# Altium project quadruped.PrjPCB
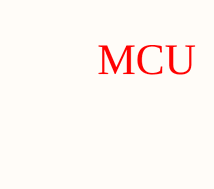
[diagram p0: quadruped.SchDoc, top left]
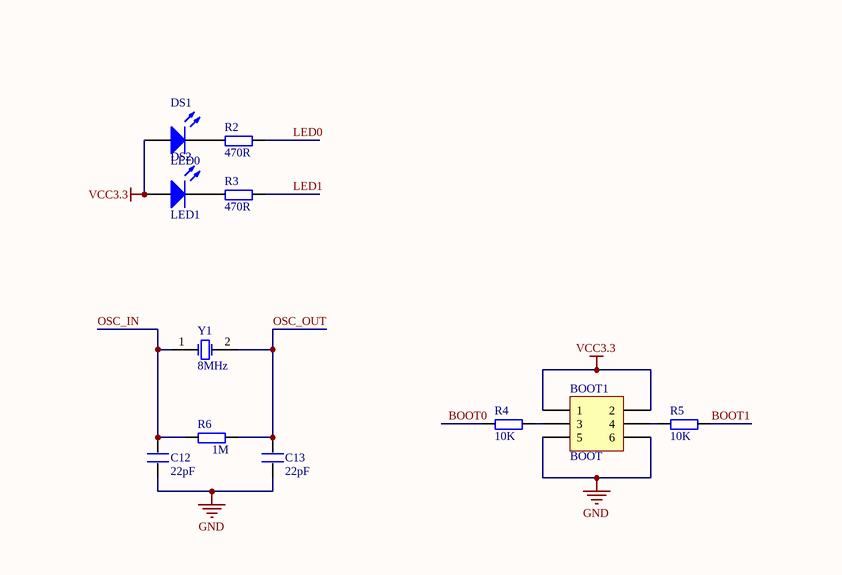
[diagram p1: quadruped.SchDoc, top right]
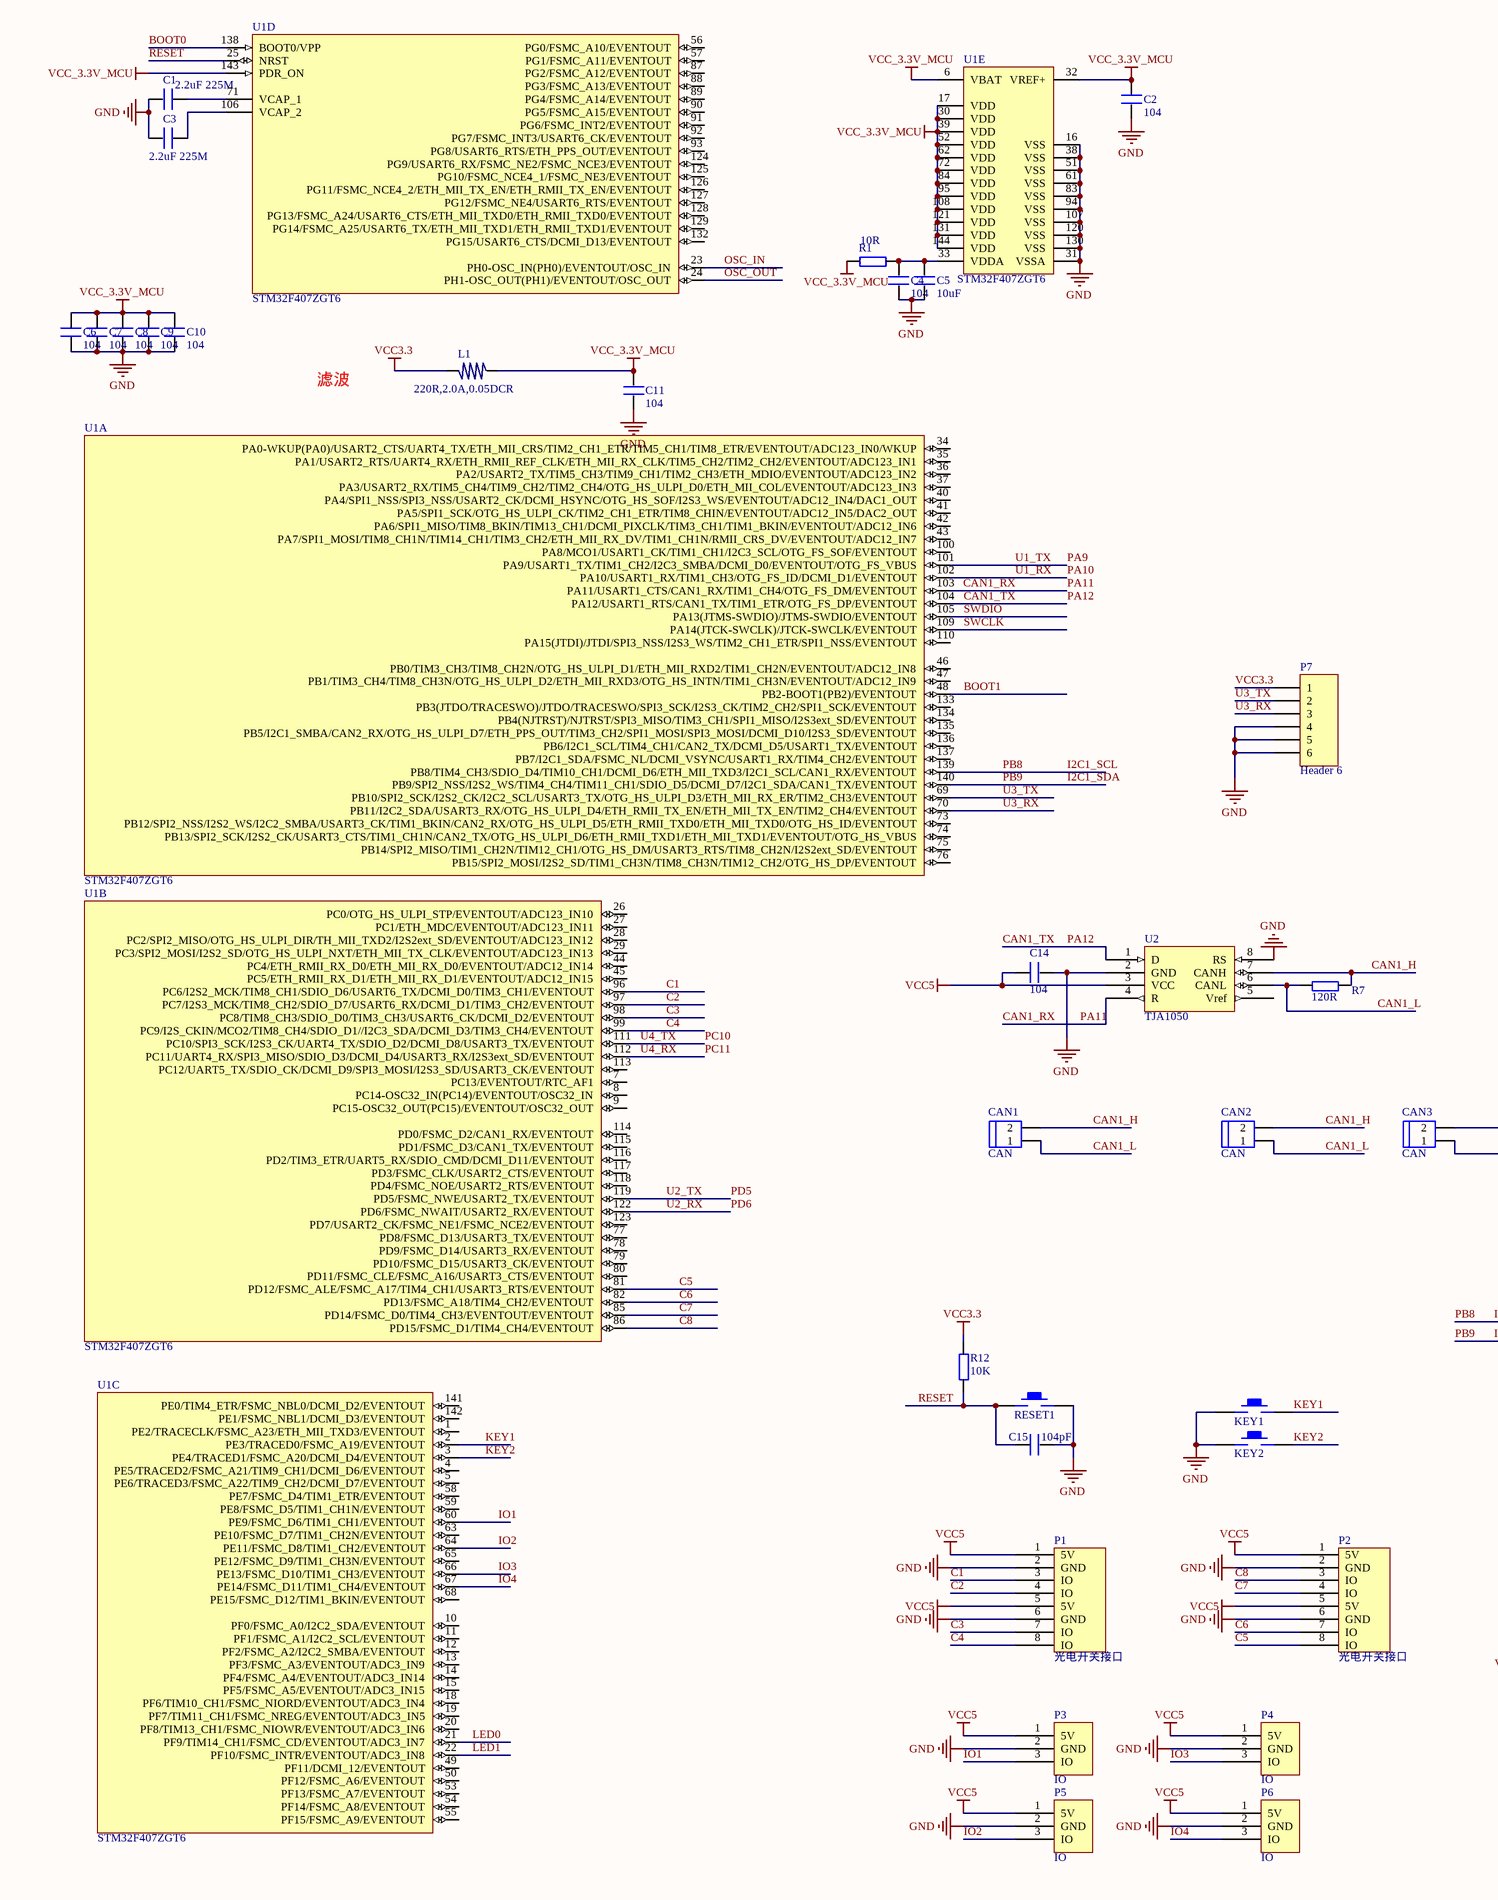
[diagram p2: quadruped.SchDoc, bottom left]
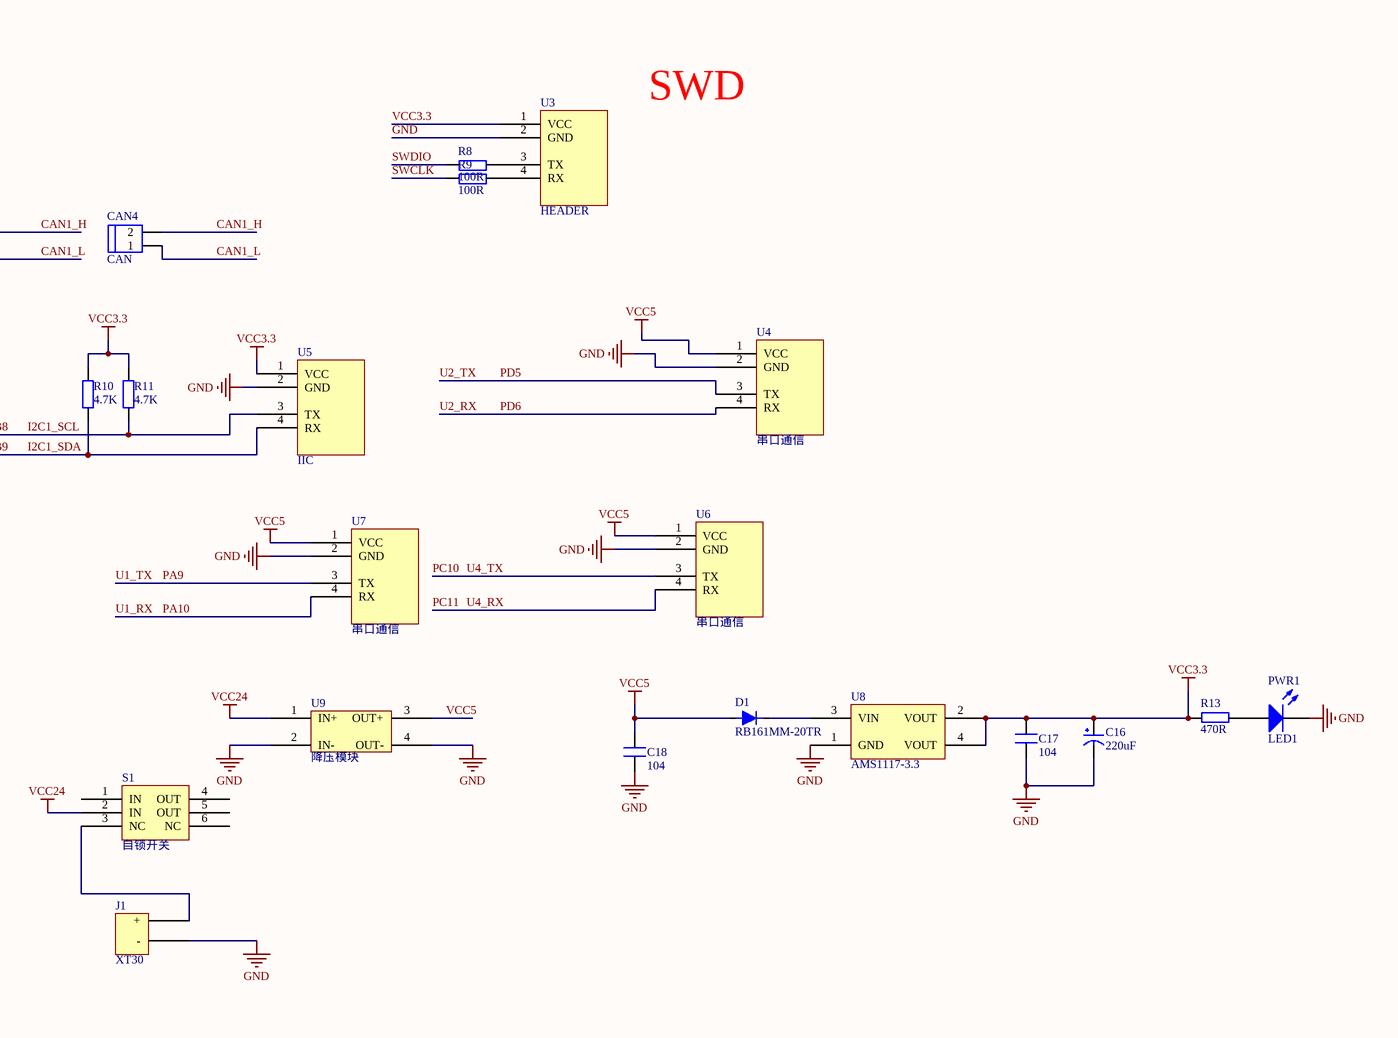
[diagram p3: quadruped.SchDoc, bottom right]
1 sheet, 63 parts. Net scope: global (net labels, ports and power ports of the same name join across sheets).
Board file: quadruped.PcbDoc

## Sheet quadruped.SchDoc
size A1

### Parts
BOOT1  BOOT  [HDR2X3]
C1  2.2uF 225M  [0603C]
C2  104  [0603C]
C3  2.2uF 225M  [0603C]
C4  104  [0603C]
C5  10uF  [0603C]
C6  104  [0603C]
C7  104  [0603C]
C8  104  [0603C]
C9  104  [0603C]
C10  104  [0603C]
C11  104  [0603C]
C12  22pF  [0603C]
C13  22pF  [0603C]
C14  104  [0603C]
C15  104pF  [C0603]
C16  220uF  [C3528]
C17  104  [0603C]
C18  104  [0603C]
CAN1  CAN  [KF3.81直针-2P]
CAN2  CAN  [KF3.81直针-2P]
CAN3  CAN  [KF3.81直针-2P]
CAN4  CAN  [KF3.81直针-2P]
D1  RB161MM-20TR  [LC-SOD-123F]
DS1  LED0  [0603_LED]
DS2  LED1  [0603_LED]
J1  XT30  [POWER_PAD]
KEY1  KEY0  [KEY_M]  (value not drawn)
KEY2  KEY0  [KEY_M]  (value not drawn)
L1  220R,2.0A,0.05DCR  [0603_L]
P1  光电开关接口  [KF3.81直针-8P]
P2  光电开关接口  [KF3.81直针-8P]
P3  IO  [KF3.81直针-3P]
P4  IO  [KF3.81直针-3P]
P5  IO  [KF3.81直针-3P]
P6  IO  [KF3.81直针-3P]
P7  Header 6  [HDR1X6]
PWR1  LED1  [0603_LED]
R1  10R  [0603R]
R2  470R  [0603R]
R3  470R  [0603R]
R4  10K  [R0603]
R5  10K  [R0603]
R6  1M  [0603R]
R7  120R  [0603R]
R8  100R  [0603R]
R9  100R  [0603R]
R10  4.7K  [0603R]
R11  4.7K  [0603R]
R12  10K  [R0603]
R13  470R  [0603R]
RESET1  KEY_M  [KEY_4]  (value not drawn)
S1  自锁开关  [自锁开关5.8*5.8]
U1  STM32F407ZGT6  [LQFP144]  (parts A,B,C,D,E of 5)
U2  TJA1050  [SOP8]
U3  HEADER  [XH2.54-4]
U4  串口通信  [XH2.54-4]
U5  IIC  [XH2.54-4]
U6  串口通信  [XH2.54-4]
U7  串口通信  [XH2.54-4]
U8  AMS1117-3.3  [SOT223]
U9  降压模块  [MP1584N DC-DC]
Y1  8MHz  [XTAL_US]

### Nets
GND: BOOT1.5 BOOT1.6 C1.1 C2.1 C3.2 C4.1 C5.1 C6.1 C7.1 C8.1 C9.1 C10.1 C11.1 C12.1 C13.1 C14.2 C15.1 C16.2(GND) C17.1 C18.1 J1.0(-) KEY1.1 KEY2.1 P1.2(GND) P1.6(GND) P2.2(GND) P2.6(GND) P3.2(GND) P4.2(GND) P5.2(GND) P6.2(GND) P7.4 P7.5 P7.6 PWR1.2(K) RESET1.2 U1.16(VSS) U1.31(VSSA) U1.38(VSS) U1.51(VSS) U1.61(VSS) U1.83(VSS) U1.94(VSS) U1.107(VSS) U1.120(VSS) U1.130(VSS) U2.2(GND) U2.8(RS) U3.2(GND) U4.2(GND) U5.2(GND) U6.2(GND) U7.2(GND) U8.1(GND) U9.2(IN-) U9.4(OUT-)
VCC3.3: BOOT1.1 BOOT1.2 C16.1(VCC) C17.2 DS1.1(A) DS2.1(A) L1.2 P7.1 R10.2 R11.2 R12.2 R13.2 U3.1(VCC) U5.1(VCC) U8.2(VOUT) U8.4(VOUT)
VCC5: C14.1 C18.2 D1.1 P1.1(5V) P1.5(5V) P2.1(5V) P2.5(5V) P3.1(5V) P4.1(5V) P5.1(5V) P6.1(5V) U2.3(VCC) U4.1(VCC) U6.1(VCC) U7.1(VCC) U9.3(OUT+)
VCC24: S1.2(IN) U9.1(IN+)
VCC_3.3V_MCU: C2.2 C6.2 C7.2 C8.2 C9.2 C10.2 C11.2 L1.1 R1.1 U1.6(VBAT) U1.17(VDD) U1.30(VDD) U1.32(VREF+) U1.39(VDD) U1.52(VDD) U1.62(VDD) U1.72(VDD) U1.84(VDD) U1.95(VDD) U1.108(VDD) U1.121(VDD) U1.131(VDD) U1.143(PDR_ON) U1.144(VDD)
BOOT0: R4.1 U1.138(BOOT0/VPP)
BOOT1: R5.2 U1.48(PB2-BOOT1(PB2)/EVENTOUT)
C1: P1.3(IO) U1.96(PC6/I2S2_MCK/TIM8_CH1/SDIO_D6/USART6_TX/DCMI_D0/TIM3_CH1/EVENTOUT)
C2: P1.4(IO) U1.97(PC7/I2S3_MCK/TIM8_CH2/SDIO_D7/USART6_RX/DCMI_D1/TIM3_CH2/EVENTOUT)
C3: P1.7(IO) U1.98(PC8/TIM8_CH3/SDIO_D0/TIM3_CH3/USART6_CK/DCMI_D2/EVENTOUT)
C4: P1.8(IO) U1.99(PC9/I2S_CKIN/MCO2/TIM8_CH4/SDIO_D1//I2C3_SDA/DCMI_D3/TIM3_CH4/EVENTOUT)
C5: P2.8(IO) U1.81(PD12/FSMC_ALE/FSMC_A17/TIM4_CH1/USART3_RTS/EVENTOUT)
C6: P2.7(IO) U1.82(PD13/FSMC_A18/TIM4_CH2/EVENTOUT)
C7: P2.4(IO) U1.85(PD14/FSMC_D0/TIM4_CH3/EVENTOUT/EVENTOUT)
C8: P2.3(IO) U1.86(PD15/FSMC_D1/TIM4_CH4/EVENTOUT)
CAN1_H: CAN1.2 CAN2.2 CAN3.2 CAN4.2 R7.2 U2.7(CANH)
CAN1_L: CAN1.1 CAN2.1 CAN3.1 CAN4.1 R7.1 U2.6(CANL)
CAN1_RX: U1.103(PA11/USART1_CTS/CAN1_RX/TIM1_CH4/OTG_FS_DM/EVENTOUT) U2.4(R)  [also labelled PA11]
CAN1_TX: U1.104(PA12/USART1_RTS/CAN1_TX/TIM1_ETR/OTG_FS_DP/EVENTOUT) U2.1(D)  [also labelled PA12]
I2C1_SCL: R11.1 U1.139(PB8/TIM4_CH3/SDIO_D4/TIM10_CH1/DCMI_D6/ETH_MII_TXD3/I2C1_SCL/CAN1_RX/EVENTOUT) U5.3(TX)  [also labelled PB8]
I2C1_SDA: R10.1 U1.140(PB9/SPI2_NSS/I2S2_WS/TIM4_CH4/TIM11_CH1/SDIO_D5/DCMI_D7/I2C1_SDA/CAN1_TX/EVENTOUT) U5.4(RX)  [also labelled PB9]
IO1: P3.3(IO) U1.60(PE9/FSMC_D6/TIM1_CH1/EVENTOUT)
IO2: P5.3(IO) U1.64(PE11/FSMC_D8/TIM1_CH2/EVENTOUT)
IO3: P4.3(IO) U1.66(PE13/FSMC_D10/TIM1_CH3/EVENTOUT)
IO4: P6.3(IO) U1.67(PE14/FSMC_D11/TIM1_CH4/EVENTOUT)
KEY1: KEY1.2 U1.2(PE3/TRACED0/FSMC_A19/EVENTOUT)
KEY2: KEY2.2 U1.3(PE4/TRACED1/FSMC_A20/DCMI_D4/EVENTOUT)
LED0: R2.2 U1.21(PF9/TIM14_CH1/FSMC_CD/EVENTOUT/ADC3_IN7)
LED1: R3.2 U1.22(PF10/FSMC_INTR/EVENTOUT/ADC3_IN8)
OSC_IN: C12.2 R6.1 U1.23(PH0-OSC_IN(PH0)/EVENTOUT/OSC_IN) Y1.1(OSC1)
OSC_OUT: C13.2 R6.2 U1.24(PH1-OSC_OUT(PH1)/EVENTOUT/OSC_OUT) Y1.2(OSC2)
PA9: U1.101(PA9/USART1_TX/TIM1_CH2/I2C3_SMBA/DCMI_D0/EVENTOUT/OTG_FS_VBUS) U7.3(TX)  [also labelled U1_TX]
PA10: U1.102(PA10/USART1_RX/TIM1_CH3/OTG_FS_ID/DCMI_D1/EVENTOUT) U7.4(RX)  [also labelled U1_RX]
PC10: U1.111(PC10/SPI3_SCK/I2S3_CK/UART4_TX/SDIO_D2/DCMI_D8/USART3_TX/EVENTOUT) U6.3(TX)  [also labelled U4_TX]
PC11: U1.112(PC11/UART4_RX/SPI3_MISO/SDIO_D3/DCMI_D4/USART3_RX/I2S3ext_SD/EVENTOUT) U6.4(RX)  [also labelled U4_RX]
PD5: U1.119(PD5/FSMC_NWE/USART2_TX/EVENTOUT) U4.3(TX)  [also labelled U2_TX]
PD6: U1.122(PD6/FSMC_NWAIT/USART2_RX/EVENTOUT) U4.4(RX)  [also labelled U2_RX]
RESET: C15.2 R12.1 RESET1.1 U1.25(NRST)
SWCLK: R9.1 U1.109(PA14(JTCK-SWCLK)/JTCK-SWCLK/EVENTOUT)
SWDIO: R8.1 U1.105(PA13(JTMS-SWDIO)/JTMS-SWDIO/EVENTOUT)
U3_RX: P7.3 U1.70(PB11/I2C2_SDA/USART3_RX/OTG_HS_ULPI_D4/ETH_RMII_TX_EN/ETH_MII_TX_EN/TIM2_CH4/EVENTOUT)
U3_TX: P7.2 U1.69(PB10/SPI2_SCK/I2S2_CK/I2C2_SCL/USART3_TX/OTG_HS_ULPI_D3/ETH_MII_RX_ER/TIM2_CH3/EVENTOUT)
NetBOOT1_3: BOOT1.3 R4.2
NetBOOT1_4: BOOT1.4 R5.1
NetC1_2: C1.2 U1.71(VCAP_1)
NetC3_1: C3.1 U1.106(VCAP_2)
NetC4_2: C4.2 C5.2 R1.2 U1.33(VDDA)
NetD1_2: D1.2 U8.3(VIN)
NetDS1_2: DS1.2(K) R2.1
NetDS2_2: DS2.2(K) R3.1
NetJ1_1: J1.1(+) S1.3(NC)
NetPWR1_1: PWR1.1(A) R13.1
NetR8_2: R8.2 U3.3(TX)
NetR9_2: R9.2 U3.4(RX)

Not connected (* = marked no-connect by the designer): S1 1(IN) 4(OUT) 5(OUT) 6(NC); U1 1(PE2/TRACECLK/FSMC_A23/ETH_MII_TXD3/EVENTOUT) 4(PE5/TRACED2/FSMC_A21/TIM9_CH1/DCMI_D6/EVENTOUT) 5(PE6/TRACED3/FSMC_A22/TIM9_CH2/DCMI_D7/EVENTOUT) 7(PC13/EVENTOUT/RTC_AF1) 8(PC14-OSC32_IN(PC14)/EVENTOUT/OSC32_IN) 9(PC15-OSC32_OUT(PC15)/EVENTOUT/OSC32_OUT) 10(PF0/FSMC_A0/I2C2_SDA/EVENTOUT) 11(PF1/FSMC_A1/I2C2_SCL/EVENTOUT) 12(PF2/FSMC_A2/I2C2_SMBA/EVENTOUT) 13(PF3/FSMC_A3/EVENTOUT/ADC3_IN9) 14(PF4/FSMC_A4/EVENTOUT/ADC3_IN14) 15(PF5/FSMC_A5/EVENTOUT/ADC3_IN15) 18(PF6/TIM10_CH1/FSMC_NIORD/EVENTOUT/ADC3_IN4) 19(PF7/TIM11_CH1/FSMC_NREG/EVENTOUT/ADC3_IN5) 20(PF8/TIM13_CH1/FSMC_NIOWR/EVENTOUT/ADC3_IN6) 26(PC0/OTG_HS_ULPI_STP/EVENTOUT/ADC123_IN10) 27(PC1/ETH_MDC/EVENTOUT/ADC123_IN11) 28(PC2/SPI2_MISO/OTG_HS_ULPI_DIR/TH_MII_TXD2/I2S2ext_SD/EVENTOUT/ADC123_IN12) 29(PC3/SPI2_MOSI/I2S2_SD/OTG_HS_ULPI_NXT/ETH_MII_TX_CLK/EVENTOUT/ADC123_IN13) 34(PA0-WKUP(PA0)/USART2_CTS/UART4_TX/ETH_MII_CRS/TIM2_CH1_ETR/TIM5_CH1/TIM8_ETR/EVENTOUT/ADC123_IN0/WKUP) 35(PA1/USART2_RTS/UART4_RX/ETH_RMII_REF_CLK/ETH_MII_RX_CLK/TIM5_CH2/TIM2_CH2/EVENTOUT/ADC123_IN1) 36(PA2/USART2_TX/TIM5_CH3/TIM9_CH1/TIM2_CH3/ETH_MDIO/EVENTOUT/ADC123_IN2) 37(PA3/USART2_RX/TIM5_CH4/TIM9_CH2/TIM2_CH4/OTG_HS_ULPI_D0/ETH_MII_COL/EVENTOUT/ADC123_IN3) 40(PA4/SPI1_NSS/SPI3_NSS/USART2_CK/DCMI_HSYNC/OTG_HS_SOF/I2S3_WS/EVENTOUT/ADC12_IN4/DAC1_OUT) 41(PA5/SPI1_SCK/OTG_HS_ULPI_CK/TIM2_CH1_ETR/TIM8_CHIN/EVENTOUT/ADC12_IN5/DAC2_OUT) 42(PA6/SPI1_MISO/TIM8_BKIN/TIM13_CH1/DCMI_PIXCLK/TIM3_CH1/TIM1_BKIN/EVENTOUT/ADC12_IN6) 43(PA7/SPI1_MOSI/TIM8_CH1N/TIM14_CH1/TIM3_CH2/ETH_MII_RX_DV/TIM1_CH1N/RMII_CRS_DV/EVENTOUT/ADC12_IN7) 44(PC4/ETH_RMII_RX_D0/ETH_MII_RX_D0/EVENTOUT/ADC12_IN14) 45(PC5/ETH_RMII_RX_D1/ETH_MII_RX_D1/EVENTOUT/ADC12_IN15) 46(PB0/TIM3_CH3/TIM8_CH2N/OTG_HS_ULPI_D1/ETH_MII_RXD2/TIM1_CH2N/EVENTOUT/ADC12_IN8) 47(PB1/TIM3_CH4/TIM8_CH3N/OTG_HS_ULPI_D2/ETH_MII_RXD3/OTG_HS_INTN/TIM1_CH3N/EVENTOUT/ADC12_IN9) 49(PF11/DCMI_12/EVENTOUT) 50(PF12/FSMC_A6/EVENTOUT) 53(PF13/FSMC_A7/EVENTOUT) 54(PF14/FSMC_A8/EVENTOUT) 55(PF15/FSMC_A9/EVENTOUT) 56(PG0/FSMC_A10/EVENTOUT) 57(PG1/FSMC_A11/EVENTOUT) 58(PE7/FSMC_D4/TIM1_ETR/EVENTOUT) 59(PE8/FSMC_D5/TIM1_CH1N/EVENTOUT) 63(PE10/FSMC_D7/TIM1_CH2N/EVENTOUT) 65(PE12/FSMC_D9/TIM1_CH3N/EVENTOUT) 68(PE15/FSMC_D12/TIM1_BKIN/EVENTOUT) 73(PB12/SPI2_NSS/I2S2_WS/I2C2_SMBA/USART3_CK/TIM1_BKIN/CAN2_RX/OTG_HS_ULPI_D5/ETH_RMII_TXD0/ETH_MII_TXD0/OTG_HS_ID/EVENTOUT) 74(PB13/SPI2_SCK/I2S2_CK/USART3_CTS/TIM1_CH1N/CAN2_TX/OTG_HS_ULPI_D6/ETH_RMII_TXD1/ETH_MII_TXD1/EVENTOUT/OTG_HS_VBUS) 75(PB14/SPI2_MISO/TIM1_CH2N/TIM12_CH1/OTG_HS_DM/USART3_RTS/TIM8_CH2N/I2S2ext_SD/EVENTOUT) 76(PB15/SPI2_MOSI/I2S2_SD/TIM1_CH3N/TIM8_CH3N/TIM12_CH2/OTG_HS_DP/EVENTOUT) 77(PD8/FSMC_D13/USART3_TX/EVENTOUT) 78(PD9/FSMC_D14/USART3_RX/EVENTOUT) 79(PD10/FSMC_D15/USART3_CK/EVENTOUT) 80(PD11/FSMC_CLE/FSMC_A16/USART3_CTS/EVENTOUT) 87(PG2/FSMC_A12/EVENTOUT) 88(PG3/FSMC_A13/EVENTOUT) 89(PG4/FSMC_A14/EVENTOUT) 90(PG5/FSMC_A15/EVENTOUT) 91(PG6/FSMC_INT2/EVENTOUT) 92(PG7/FSMC_INT3/USART6_CK/EVENTOUT) 93(PG8/USART6_RTS/ETH_PPS_OUT/EVENTOUT) 100(PA8/MCO1/USART1_CK/TIM1_CH1/I2C3_SCL/OTG_FS_SOF/EVENTOUT) 110(PA15(JTDI)/JTDI/SPI3_NSS/I2S3_WS/TIM2_CH1_ETR/SPI1_NSS/EVENTOUT) 113(PC12/UART5_TX/SDIO_CK/DCMI_D9/SPI3_MOSI/I2S3_SD/USART3_CK/EVENTOUT) 114(PD0/FSMC_D2/CAN1_RX/EVENTOUT) 115(PD1/FSMC_D3/CAN1_TX/EVENTOUT) 116(PD2/TIM3_ETR/UART5_RX/SDIO_CMD/DCMI_D11/EVENTOUT) 117(PD3/FSMC_CLK/USART2_CTS/EVENTOUT) 118(PD4/FSMC_NOE/USART2_RTS/EVENTOUT) 123(PD7/USART2_CK/FSMC_NE1/FSMC_NCE2/EVENTOUT) 124(PG9/USART6_RX/FSMC_NE2/FSMC_NCE3/EVENTOUT) 125(PG10/FSMC_NCE4_1/FSMC_NE3/EVENTOUT) 126(PG11/FSMC_NCE4_2/ETH_MII_TX_EN/ETH_RMII_TX_EN/EVENTOUT) 127(PG12/FSMC_NE4/USART6_RTS/EVENTOUT) 128(PG13/FSMC_A24/USART6_CTS/ETH_MII_TXD0/ETH_RMII_TXD0/EVENTOUT) 129(PG14/FSMC_A25/USART6_TX/ETH_MII_TXD1/ETH_RMII_TXD1/EVENTOUT) 132(PG15/USART6_CTS/DCMI_D13/EVENTOUT) 133(PB3(JTDO/TRACESWO)/JTDO/TRACESWO/SPI3_SCK/I2S3_CK/TIM2_CH2/SPI1_SCK/EVENTOUT) 134(PB4(NJTRST)/NJTRST/SPI3_MISO/TIM3_CH1/SPI1_MISO/I2S3ext_SD/EVENTOUT) 135(PB5/I2C1_SMBA/CAN2_RX/OTG_HS_ULPI_D7/ETH_PPS_OUT/TIM3_CH2/SPI1_MOSI/SPI3_MOSI/DCMI_D10/I2S3_SD/EVENTOUT) 136(PB6/I2C1_SCL/TIM4_CH1/CAN2_TX/DCMI_D5/USART1_TX/EVENTOUT) 137(PB7/I2C1_SDA/FSMC_NL/DCMI_VSYNC/USART1_RX/TIM4_CH2/EVENTOUT) 141(PE0/TIM4_ETR/FSMC_NBL0/DCMI_D2/EVENTOUT) 142(PE1/FSMC_NBL1/DCMI_D3/EVENTOUT); U2 5(Vref)

### Notes on the sheet
- MCU
- 滤波
- SWD

### Library data of the parts
BOOT1 = Header 3X2: Header, 3-Pin, Dual row; LatestRevisionDate: 17-Jul-2002; LatestRevisionNote: Re-released for DXP Platform.; Publisher: Altium Limited
C1 C3-C15 C17 C18 = C
C2 = C_1
C16 = CAP
CAN1-CAN4 = HEAD2
D1 = 肖特基
DS1 DS2 PWR1 = LED2: Typical RED, GREEN, YELLOW, AMBER GaAs LED; Published: 8-Jun-2000; LatestRevisionDate: 17-Jul-2002; LatestRevisionNote: Re-released for DXP Platform.; PackageDocument: Feb-2002; PackageReference: 3.2X1.6X1.1; Publisher: Altium Limited
KEY1 KEY2 = KEY_M
L1 = L
P1 P2 = KF3.81-8P
P7 = Header 6: Header, 6-Pin; LatestRevisionDate: 17-Jul-2002; LatestRevisionNote: Re-released for DXP Platform.; Publisher: Altium Limited
R1-R9 R12 R13 = R
R10 R11 = R-0805
S1 = Switch_5.8
U1 = STM32F407ZGT6: ARM Cortex-M4 32b MCU+FPU, 210DMIP, 1024 kB Flash, 192+4 kB RAM, Camera, 114 I/Os, 144-pin LQFP, -40 to +85癈, Tray; Internal RAM: 192kB; Operating Frequency (Processor Speed): 168MHz; A/D Converter: 24x12-bit; D/A Converter: 2x12-bit; 16-bit Timers (IC/OC/PWM): 12x16-bit(24/24/30); 32-bit Timer (IC/OC/PWM): 2x32-bit (8/8/8); Other Timer Functions: 2xWDG, RTC, 24-bit down counter; Serial Interface: 3xSPI/2xI2S/2xI2C/3xUSART(IrDa, ISO7816)/3xUART/2xUSB OTG FS/HS, 2xCAN/Ethernet MAC10/100, SDIO; DatasheetVersion: rev2, Jan-2012; PackageVersion: 2012; PackageReference: TQFP144; PackageDescription: 144-Pin Low Profile Quad Flat Package, 20x20 mm Body, 0.5 mm Pitch; ComponentLink1Description: Manufacturer URL; ComponentLink1URL: http://www.st.com/; ComponentLink2Description: STM32F405/7 Datasheet; ComponentLink2URL: http://www.st.com/internet/com/TECHNICAL_RESOURCES/TECHNICAL_LITERATURE/DATASHEET/DM00037051.pdf; ComponentLink3Description: STM32F4 Web Page; ComponentLink3URL: http://www.st.com/internet/mcu/subclass/1521.jsp
U2 = SN65HVD230D
U3-U7 = XH2.54插座-4P
U8 = AMS1117
U9 = MP1584N 降压模块
Y1 = XTAL: Crystal Oscillator; Published: 8-Jun-2000; LatestRevisionDate: 17-Jul-2002; LatestRevisionNote: Re-released for DXP Platform.; Publisher: Altium Limited